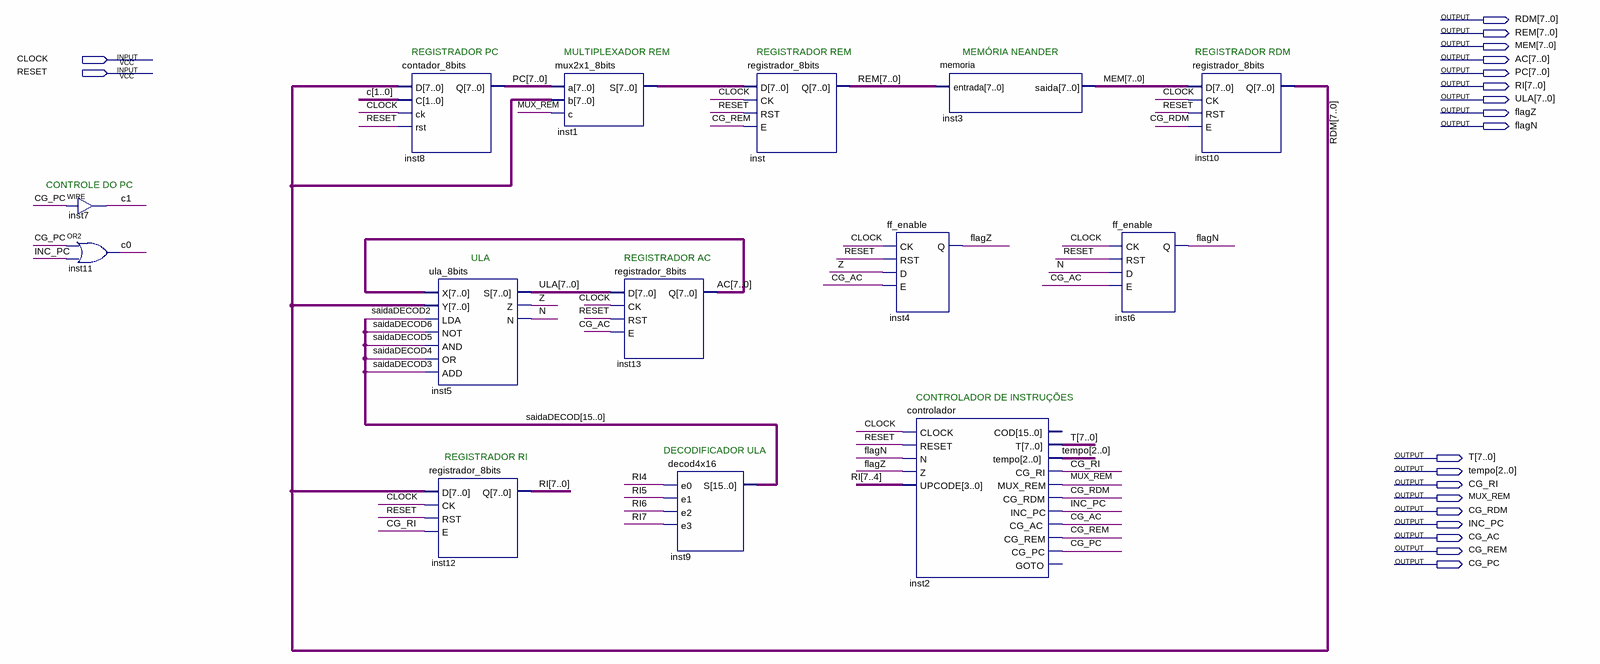
[diagram p0: schematic sheet]
// Quartus schematic neander.bdf as structural Verilog: 14 symbols, 20 pins
module neander (
  input  CLOCK,
  input  RESET,
  output [7:0] RDM,
  output [7:0] REM,
  output [7:0] MEM,
  output [7:0] AC,
  output [7:0] PC,
  output [7:0] RI,
  output [7:0] ULA,
  output flagZ,
  output flagN,
  output [7:0] T,
  output [2:0] tempo,
  output CG_RI,
  output MUX_REM,
  output CG_RDM,
  output INC_PC,
  output CG_AC,
  output CG_REM,
  output CG_PC
);

  wire N, Z;
  wire [1:0] c;
  wire [7:0] inst1_s;
  wire [15:0] saidaDECOD;

  assign c[1] = CG_PC;  // WIRE inst7
  or inst11 (c[0], CG_PC, INC_PC);
  contador_8bits inst8 (.D(RDM), .C(c), .ck(CLOCK), .rst(RESET), .Q(PC));
  ula_8bits inst5 (
    .X(AC), .Y(RDM), .LDA(saidaDECOD[2]), .NOT(saidaDECOD[6]), .AND(saidaDECOD[5]), .OR(saidaDECOD[4]),
    .ADD(saidaDECOD[3]), .S(ULA), .Z(Z), .N(N));
  registrador_8bits inst12 (.D(RDM), .CK(CLOCK), .RST(RESET), .E(CG_RI), .Q(RI));
  mux2x1_8bits inst1 (.a(PC), .b(RDM), .c(MUX_REM), .S(inst1_s));
  registrador_8bits inst13 (.D(ULA), .CK(CLOCK), .RST(RESET), .E(CG_AC), .Q(AC));
  decod4x16 inst9 (.e0(RI[4]), .e1(RI[5]), .e2(RI[6]), .e3(RI[7]), .S(saidaDECOD));
  registrador_8bits inst (.D(inst1_s), .CK(CLOCK), .RST(RESET), .E(CG_REM), .Q(REM));
  ff_enable inst4 (.CK(CLOCK), .RST(RESET), .D(Z), .E(CG_AC), .Q(flagZ));
  memoria inst3 (.entrada(REM), .saida(MEM));
  controlador inst2 (
    .CLOCK(CLOCK), .RESET(RESET), .N(flagN), .Z(flagZ), .UPCODE(RI[7:4]), .T(T), .tempo(tempo),
    .CG_RI(CG_RI), .MUX_REM(MUX_REM), .CG_RDM(CG_RDM), .INC_PC(INC_PC), .CG_AC(CG_AC), .CG_REM(CG_REM),
    .CG_PC(CG_PC));  // open: COD, GOTO
  ff_enable inst6 (.CK(CLOCK), .RST(RESET), .D(N), .E(CG_AC), .Q(flagN));
  registrador_8bits inst10 (.D(MEM), .CK(CLOCK), .RST(RESET), .E(CG_RDM), .Q(RDM));

  // Notes on the sheet:
  //   REGISTRADOR PC
  //   MULTIPLEXADOR REM
  //   REGISTRADOR REM
  //   MEMÓRIA NEANDER
  //   REGISTRADOR RDM
  //   CONTROLE DO PC
  //   ULA
  //   REGISTRADOR AC
  //   CONTROLADOR DE INSTRUÇÕES
  //   DECODIFICADOR ULA
  //   REGISTRADOR RI
endmodule
